# Altium schematic sheet SENSE.SchDoc
size B; Organization: Altium Limited; Address1: L3, 12a Rodborough Rd; Address2: Frenchs Forest; Address3: NSW; Address4: Australia 2086
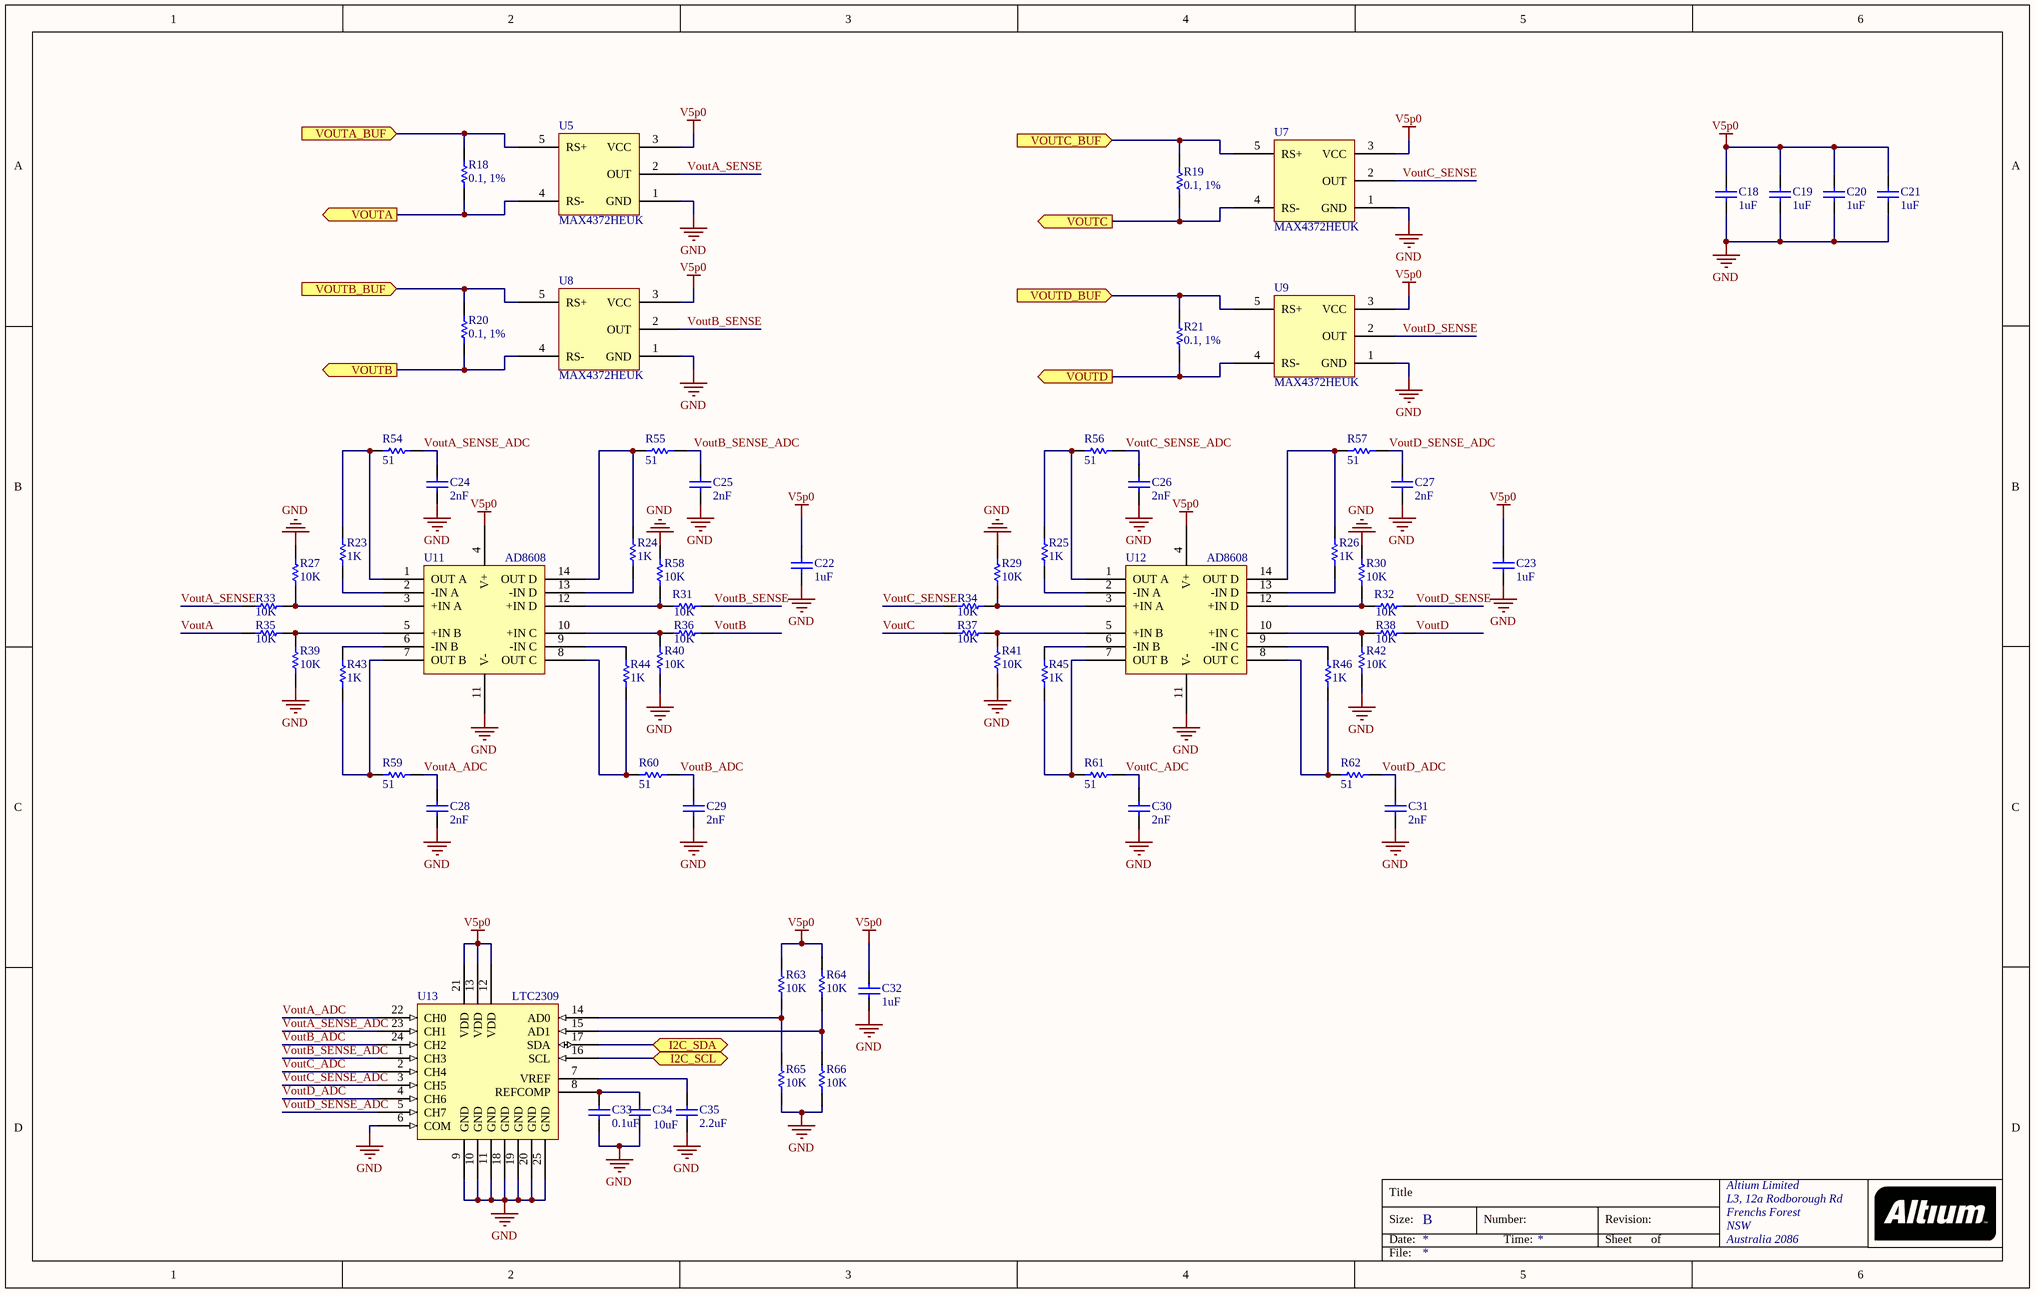
[diagram p0: SENSE.SchDoc]

## Parts
C18  value 1uF  [CAPC01005(0402)22_N]  (hidden comment: CAP, 0402, 1uF)
C19  value 1uF  [CAPC01005(0402)22_N]  (hidden comment: CAP, 0402, 1uF)
C20  value 1uF  [CAPC01005(0402)22_N]  (hidden comment: CAP, 0402, 1uF)
C21  value 1uF  [CAPC01005(0402)22_N]  (hidden comment: CAP, 0402, 1uF)
C22  value 1uF  [CAPC01005(0402)22_N]  (hidden comment: CAP, 0402, 1uF)
C23  value 1uF  [CAPC01005(0402)22_N]  (hidden comment: CAP, 0402, 1uF)
C24  value 2nF  [CAPC01005(0402)22_N]  (hidden comment: CAP, 0402, 2nF)
C25  value 2nF  [CAPC01005(0402)22_N]  (hidden comment: CAP, 0402, 2nF)
C26  value 2nF  [CAPC01005(0402)22_N]  (hidden comment: CAP, 0402, 2nF)
C27  value 2nF  [CAPC01005(0402)22_N]  (hidden comment: CAP, 0402, 2nF)
C28  value 2nF  [CAPC01005(0402)22_N]  (hidden comment: CAP, 0402, 2nF)
C29  value 2nF  [CAPC01005(0402)22_N]  (hidden comment: CAP, 0402, 2nF)
C30  value 2nF  [CAPC01005(0402)22_N]  (hidden comment: CAP, 0402, 2nF)
C31  value 2nF  [CAPC01005(0402)22_N]  (hidden comment: CAP, 0402, 2nF)
C32  value 1uF  [CAPC01005(0402)22_N]  (hidden comment: CAP, 0402, 1uF)
C33  value 0.1uF  [CAPC01005(0402)22_N]  (hidden comment: CAP, 0402, 0.1uF)
C34  value 10uF  [CAPC0805(2012)130_N]  (hidden comment: CAP, 0805, 10uF)
C35  value 2.2uF  [CAPC01005(0402)22_N]  (hidden comment: CAP, 0402, 2.2uF)
R18  value 0.1, 1%  [RES, 0603]  (hidden comment: RES, 0603, 0.1, 1%)
R19  value 0.1, 1%  [RES, 0603]  (hidden comment: RES, 0603, 0.1, 1%)
R20  value 0.1, 1%  [RES, 0603]  (hidden comment: RES, 0603, 0.1, 1%)
R21  value 0.1, 1%  [RES, 0603]  (hidden comment: RES, 0603, 0.1, 1%)
R23  1K  [RES, 0603]
R24  1K  [RES, 0603]
R25  1K  [RES, 0603]
R26  1K  [RES, 0603]
R27  10K  [RES, 0603]
R29  10K  [RES, 0603]
R30  10K  [RES, 0603]
R31  10K  [RES, 0603]
R32  10K  [RES, 0603]
R33  10K  [RES, 0603]
R34  10K  [RES, 0603]
R35  10K  [RES, 0603]
R36  10K  [RES, 0603]
R37  10K  [RES, 0603]
R38  10K  [RES, 0603]
R39  10K  [RES, 0603]
R40  10K  [RES, 0603]
R41  10K  [RES, 0603]
R42  10K  [RES, 0603]
R43  1K  [RES, 0603]
R44  1K  [RES, 0603]
R45  1K  [RES, 0603]
R46  1K  [RES, 0603]
R54  51  [RES, 0603]
R55  51  [RES, 0603]
R56  51  [RES, 0603]
R57  51  [RES, 0603]
R58  10K  [RES, 0603]
R59  51  [RES, 0603]
R60  51  [RES, 0603]
R61  51  [RES, 0603]
R62  51  [RES, 0603]
R63  10K  [RES, 0603]
R64  10K  [RES, 0603]
R65  10K  [RES, 0603]
R66  10K  [RES, 0603]
U5  MAX4372HEUK  [SOT23-5, MAX4372H]
U7  MAX4372HEUK  [SOT23-5, MAX4372H]
U8  MAX4372HEUK  [SOT23-5, MAX4372H]
U9  MAX4372HEUK  [SOT23-5, MAX4372H]
U11  AD8608  [TSOP65P640X120-14N]
U12  AD8608  [TSOP65P640X120-14N]
U13  LTC2309  [QFN50P400X400X80-24N]

## Ports
I2C_SCL (bidir), I2C_SDA (bidir), VOUTA (out), VOUTA_BUF (in), VOUTB (out), VOUTB_BUF (in), VOUTC (out), VOUTC_BUF (in), VOUTD (out), VOUTD_BUF (in)

## Nets
GND: C18.1 C19.1 C20.1 C21.1 C22.1 C23.1 C24.2 C25.2 C26.2 C27.2 C28.2 C29.2 C30.2 C31.2 C32.1 C33.1 C34.1 C35.1 R27.2 R29.2 R30.1 R39.1 R40.2 R41.1 R42.2 R58.1 R65.2 R66.2 U5.1(GND) U7.1(GND) U8.1(GND) U9.1(GND) U11.11(V-) U12.11(V-) U13.6(COM) U13.9(GND) U13.10(GND) U13.11(GND) U13.18(GND) U13.19(GND) U13.20(GND) U13.25(GND)
V5p0: C18.2 C19.2 C20.2 C21.2 C22.2 C23.2 C32.2 R63.1 R64.1 U5.3(VCC) U7.3(VCC) U8.3(VCC) U9.3(VCC) U11.4(V+) U12.4(V+) U13.12(VDD) U13.13(VDD) U13.21(VDD)
I2C_SCL: U13.16(SCL) ; port I2C_SCL
I2C_SDA: U13.17(SDA) ; port I2C_SDA
VOUTA: R18.1 U5.4(RS-) ; port VOUTA
VoutA: R35.1  [a separate net that carries the same name]
VoutA_ADC: C28.1 R59.2 U13.22(CH0)
VOUTA_BUF: R18.2 U5.5(RS+) ; port VOUTA_BUF
VoutA_SENSE: R33.1 U5.2(OUT)
VoutA_SENSE_ADC: C24.1 R54.2 U13.23(CH1)
VOUTB: R20.1 U8.4(RS-) ; port VOUTB
VoutB: R36.1  [a separate net that carries the same name]
VoutB_ADC: C29.1 R60.2 U13.24(CH2)
VOUTB_BUF: R20.2 U8.5(RS+) ; port VOUTB_BUF
VoutB_SENSE: R31.1 U8.2(OUT)
VoutB_SENSE_ADC: C25.1 R55.2 U13.1(CH3)
VOUTC: R19.1 U7.4(RS-) ; port VOUTC
VoutC: R37.1  [a separate net that carries the same name]
VoutC_ADC: C30.1 R61.2 U13.2(CH4)
VOUTC_BUF: R19.2 U7.5(RS+) ; port VOUTC_BUF
VoutC_SENSE: R34.1 U7.2(OUT)
VoutC_SENSE_ADC: C26.1 R56.2 U13.3(CH5)
VOUTD: R21.1 U9.4(RS-) ; port VOUTD
VoutD: R38.1  [a separate net that carries the same name]
VoutD_ADC: C31.1 R62.2 U13.4(CH6)
VOUTD_BUF: R21.2 U9.5(RS+) ; port VOUTD_BUF
VoutD_SENSE: R32.1 U9.2(OUT)
VoutD_SENSE_ADC: C27.1 R57.2 U13.5(CH7)
NetC33_2: C33.2 C34.2 U13.8(REFCOMP)
NetC35_2: C35.2 U13.7(VREF)
NetR23_1: R23.1 U11.2(-IN_A)
NetR23_2: R23.2 R54.1 U11.1(OUT_A)
NetR24_1: R24.1 U11.13(-IN_D)
NetR24_2: R24.2 R55.1 U11.14(OUT_D)
NetR25_1: R25.1 U12.2(-IN_A)
NetR25_2: R25.2 R56.1 U12.1(OUT_A)
NetR26_1: R26.1 U12.13(-IN_D)
NetR26_2: R26.2 R57.1 U12.14(OUT_D)
NetR27_1: R27.1 R33.2 U11.3(+IN_A)
NetR29_1: R29.1 R34.2 U12.3(+IN_A)
NetR30_2: R30.2 R32.2 U12.12(+IN_D)
NetR31_2: R31.2 R58.2 U11.12(+IN_D)
NetR35_2: R35.2 R39.2 U11.5(+IN_B)
NetR36_2: R36.2 R40.1 U11.10(+IN_C)
NetR37_2: R37.2 R41.2 U12.5(+IN_B)
NetR38_2: R38.2 R42.1 U12.10(+IN_C)
NetR43_1: R43.1 R59.1 U11.7(OUT_B)
NetR43_2: R43.2 U11.6(-IN_B)
NetR44_1: R44.1 R60.1 U11.8(OUT_C)
NetR44_2: R44.2 U11.9(-IN_C)
NetR45_1: R45.1 R61.1 U12.7(OUT_B)
NetR45_2: R45.2 U12.6(-IN_B)
NetR46_1: R46.1 R62.1 U12.8(OUT_C)
NetR46_2: R46.2 U12.9(-IN_C)
NetR63_2: R63.2 R65.1 U13.14(AD0)
NetR64_2: R64.2 R66.1 U13.15(AD1)

## Notes on the sheet
- Title
- Size:
- Date:
- B
- Number:
- Time:
- Revision:
- Sheet
- of
- File:

## Library data of the parts
R18-R21 = RES, 0603, 0.1, 1%: Manufacturer: Panasonic Electronic Components; Manufacturer Part Number: ERJ-3RSFR10V; Resistance (Ohms): 0.1; Power (Watts): 0.1W, 1/10W; Temperature Coefficient: ±300ppm/°C; Description: RES 0.1 OHM 1/10W 1% 0603 SMD; Packaging: Cut Tape (CT); Tolerance: ±1%; Composition: Thick Film; Features: -; Package / Case: 0603 (1608 Metric); Supplier Device Package: 0603; Size / Dimension: 0.063" L x 0.031" W (1.60mm x 0.80mm); Height: 0.022" (0.55mm); Number of Terminations: 2; ComponentLink1URL: http://industrial.panasonic.com/www-cgi/jvcr13pz.cgi?E+PZ+3+AOA0003+ERJ3RSFR10V+7+WW; ComponentLink1Description: http://industrial.panasonic.com/www-cgi/jvcr13pz.cgi?E+PZ+3+AOA0003+ERJ3RSFR10V+7+WW; Supplier 1: Digi-Key; Supplier Part Number 1: P.10AJCT-ND; RoHS: RoHS Compliant; Category: Resistors; Stock 1: 81086; Pricing 1: 1=0.48, 50=0.1898, 100=0.1465, 250=0.11392, 500=0.0803, 1000=0.05859 (USD)
R23-R26 R43-R46 = RES_0603_1K: Resistor, 0603, 1/10W, 1K ohm; Manufacturer: Panasonic Electronic Components; Manufacturer Part Number: ERJ-3EKF1001V; Description: RES 1K OHM 1/10W 1% 0603 SMD; Tolerance: ±1%; Power (Watts): 0.1W, 1/10W; Temperature Coefficient: ±100ppm/°C; Supplier 1: Digi-Key; RoHS: RoHS Compliant; Category: Resistors; Stock 1: 3447685; Pricing 1: 1=0.1, 50=0.0138, 100=0.0105, 250=0.0078, 500=0.00576, 1000=0.00384 (USD); Packaging: Cut Tape (CT); Resistance (Ohms): 1k; Composition: Thick Film; Features: -; Package / Case: 0603 (1608 Metric); Supplier Device Package: 0603; Size / Dimension: 0.063" L x 0.031" W (1.60mm x 0.80mm); Height: 0.022" (0.55mm); Number of Terminations: 2; ComponentLink1URL: http://industrial.panasonic.com/www-cgi/jvcr13pz.cgi?E+PZ+3+AOA0002+ERJ3EKF1001V+7+WW; ComponentLink1Description: http://industrial.panasonic.com/www-cgi/jvcr13pz.cgi?E+PZ+3+AOA0002+ERJ3EKF1001V+7+WW; Supplier Part Number 1: P1.00KHCT-ND
R27 R29-R42 R58 R63-R66 = RES_0603_10K: Resistor, 0603, 1/10W, 10K ohm; Manufacturer: Panasonic Electronic Components; Manufacturer Part Number: ERJ-3EKF1002V; Description: RES 10K OHM 1/10W 1% 0603 SMD; Tolerance: ±1%; Power (Watts): 0.1W, 1/10W; Temperature Coefficient: ±100ppm/°C; Supplier 1: Digi-Key; RoHS: RoHS Compliant; Category: Resistors; Stock 1: 4631019; Pricing 1: 1=0.1, 50=0.0138, 100=0.0105, 250=0.0078, 500=0.00576, 1000=0.00384 (USD); Packaging: Cut Tape (CT); Resistance (Ohms): 10k; Composition: Thick Film; Features: -; Package / Case: 0603 (1608 Metric); Supplier Device Package: 0603; Size / Dimension: 0.063" L x 0.031" W (1.60mm x 0.80mm); Height: 0.022" (0.55mm); Number of Terminations: 2; ComponentLink1URL: http://industrial.panasonic.com/www-cgi/jvcr13pz.cgi?E+PZ+3+AOA0002+ERJ3EKF1002V+7+WW; ComponentLink1Description: http://industrial.panasonic.com/www-cgi/jvcr13pz.cgi?E+PZ+3+AOA0002+ERJ3EKF1002V+7+WW; Supplier Part Number 1: P10.0KHCT-ND
R54-R57 R59-R62 = RES_0603_51: Resistor, 0603, 1/10W, 51 ohm; Manufacturer: Panasonic Electronic Components; Manufacturer Part Number: ERJ-3EKF51R0V; Description: RES 51 OHM 1/10W 1% 0603 SMD; Tolerance: ±1%; Power (Watts): 0.1W, 1/10W; Temperature Coefficient: ±100ppm/°C; Supplier 1: Digi-Key; RoHS: RoHS Compliant; Category: Resistors; Stock 1: 80502; Pricing 1: 1=0.1, 50=0.0138, 100=0.0105, 250=0.0078, 500=0.00576, 1000=0.00384 (USD); Packaging: Cut Tape (CT); Resistance (Ohms): 51; Composition: Thick Film; Features: -; Package / Case: 0603 (1608 Metric); Supplier Device Package: 0603; Size / Dimension: 0.063" L x 0.031" W (1.60mm x 0.80mm); Height: 0.022" (0.55mm); Number of Terminations: 2; ComponentLink1URL: http://industrial.panasonic.com/www-cgi/jvcr13pz.cgi?E+PZ+3+AOA0002+ERJ3EKF51R0V+7+WW; ComponentLink1Description: http://industrial.panasonic.com/www-cgi/jvcr13pz.cgi?E+PZ+3+AOA0002+ERJ3EKF51R0V+7+WW; Supplier Part Number 1: P51.0HCT-ND
U5 U7-U9 = MAX4372H, Current-Sense, SOT23: Manufacturer: Maxim; Manufacturer PN: MAX4372HEUK+T; Supplier: Digikey; Supplier PN: MAX4372HEUK_TCT-ND; Supplier link: http://www.digikey.com/product-detail/en/MAX4372HEUK%2BT/MAX4372HEUK%2BTCT-ND/2234345; Unit price: 1.97
U11 U12 = AD8608; Quad Op-Amp: Manufacturer: Analog Devices Inc; Manufacturer Part Number: AD8608ARZ-REEL; Amplifier Type: General Purpose; Number of Circuits: 4; Output Type: Rail-to-Rail; Slew Rate: 5 V/µs; Gain Bandwidth Product: 10MHz; Current - Input Bias: 0.2pA; Voltage - Input Offset: 80µV; Current - Supply: 1mA; Current - Output / Channel: 80mA; Voltage - Supply, Single/Dual (±): 2.7 V ~ 5.5 V; Description: IC OPAMP GP 10MHZ RRO 14SOIC; Packaging: Cut Tape (CT); -3db Bandwidth: -; Operating Temperature: -40°C ~ 125°C; Mounting Type: Surface Mount; Package / Case: 14-SOIC (0.154", 3.90mm Width); Supplier Device Package: 14-SOIC; ComponentLink1URL: http://www.analog.com/static/imported-files/data_sheets/AD8605_8606_8608.pdf; ComponentLink1Description: http://www.analog.com/static/imported-files/data_sheets/AD8605_8606_8608.pdf; Supplier 1: Digi-Key; Supplier Part Number 1: AD8608ARZ-REELCT-ND; RoHS: RoHS Compliant; Stock 1: 2419; Pricing 1: 1=4.22, 10=3.785, 25=3.4036, 100=3.0954, 250=2.80196, 500=2.50858, 1000=2.11248 (USD); Category: Integrated Circuits (ICs)
U13 = LTC2309: 8-Channel, 12-Bit SAR ADC with I2C Interface; Manufacturer: Linear Technology; Manufacturer Part Number: LTC2309CUF#PBF; Number of Bits: 12; Sampling Rate (Per Second): 14k; Data Interface: I²C, Serial; Number of Converters: 1; Voltage Supply Source: Single Supply; Number of Inputs and Type: 8 Single-Ended, Unipolar; 8 Single-Ended, Bipolar; 4 Differential, Unipolar; 4 Differential, Bipolar; Description: IC ADC 12BIT SAR 24-QFN; Packaging: Tube; Operating Temperature: 0°C ~ 70°C; Mounting Type: Surface Mount; Package / Case: 24-WFQFN Exposed Pad; Supplier Device Package: 24-QFN Exposed Pad (4x4); ComponentLink1URL: http://www.linear.com/docs/25786; ComponentLink1Description: http://www.linear.com/docs/25786; Supplier 1: Digi-Key; Supplier Part Number 1: LTC2309CUF#PBF-ND; RoHS: RoHS Compliant; Category: Integrated Circuits (ICs); Stock 1: 532; Pricing 1: 1=6.31, 25=5.27, 100=4.34 (USD)
C18-C23 C32 = CAP, 0402, 1uF: Supplier 1: Digi-Key; Supplier Part Number 1: 587-3245-1-ND
C24-C31 = CAP, 0402, 2nF: Supplier 1: Digi-Key; Supplier Part Number 1: 587-1456-2-ND
C33 = CAP, 0402, 0.1uF: Supplier 1: Digi-Key; Supplier Part Number 1: 587-1456-2-ND
C34 = CAP, 0805, 10uF: Supplier 1: Digi-Key; Supplier Part Number 1: 587-2985-1-ND
C35 = CAP, 0402, 2.2uF: Supplier 1: Digi-Key; Supplier Part Number 1: 587-3245-1-ND